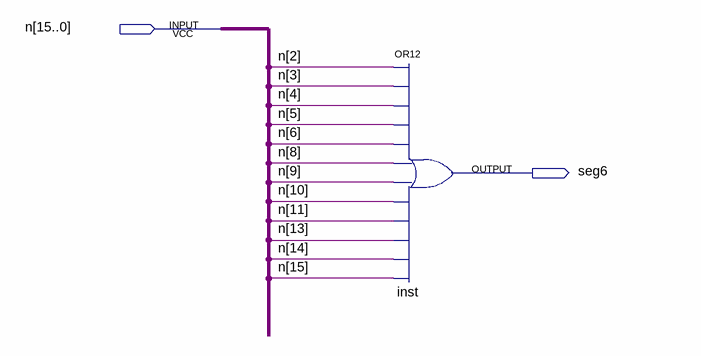
[diagram p0: schematic sheet]
// Quartus schematic seg6.bdf as structural Verilog: 1 symbols, 2 pins
module seg6 (
  input  [15:0] n,
  output seg6
);

  or inst (seg6, n[2], n[3], n[4], n[5], n[6], n[8], n[9], n[10], n[11], n[13], n[14], n[15]);
endmodule
